# Altium schematic sheet MacroUzaz_Schematic.SchDoc
size 381 x 241 mm; SheetNumber: 1; SheetTotal: 1
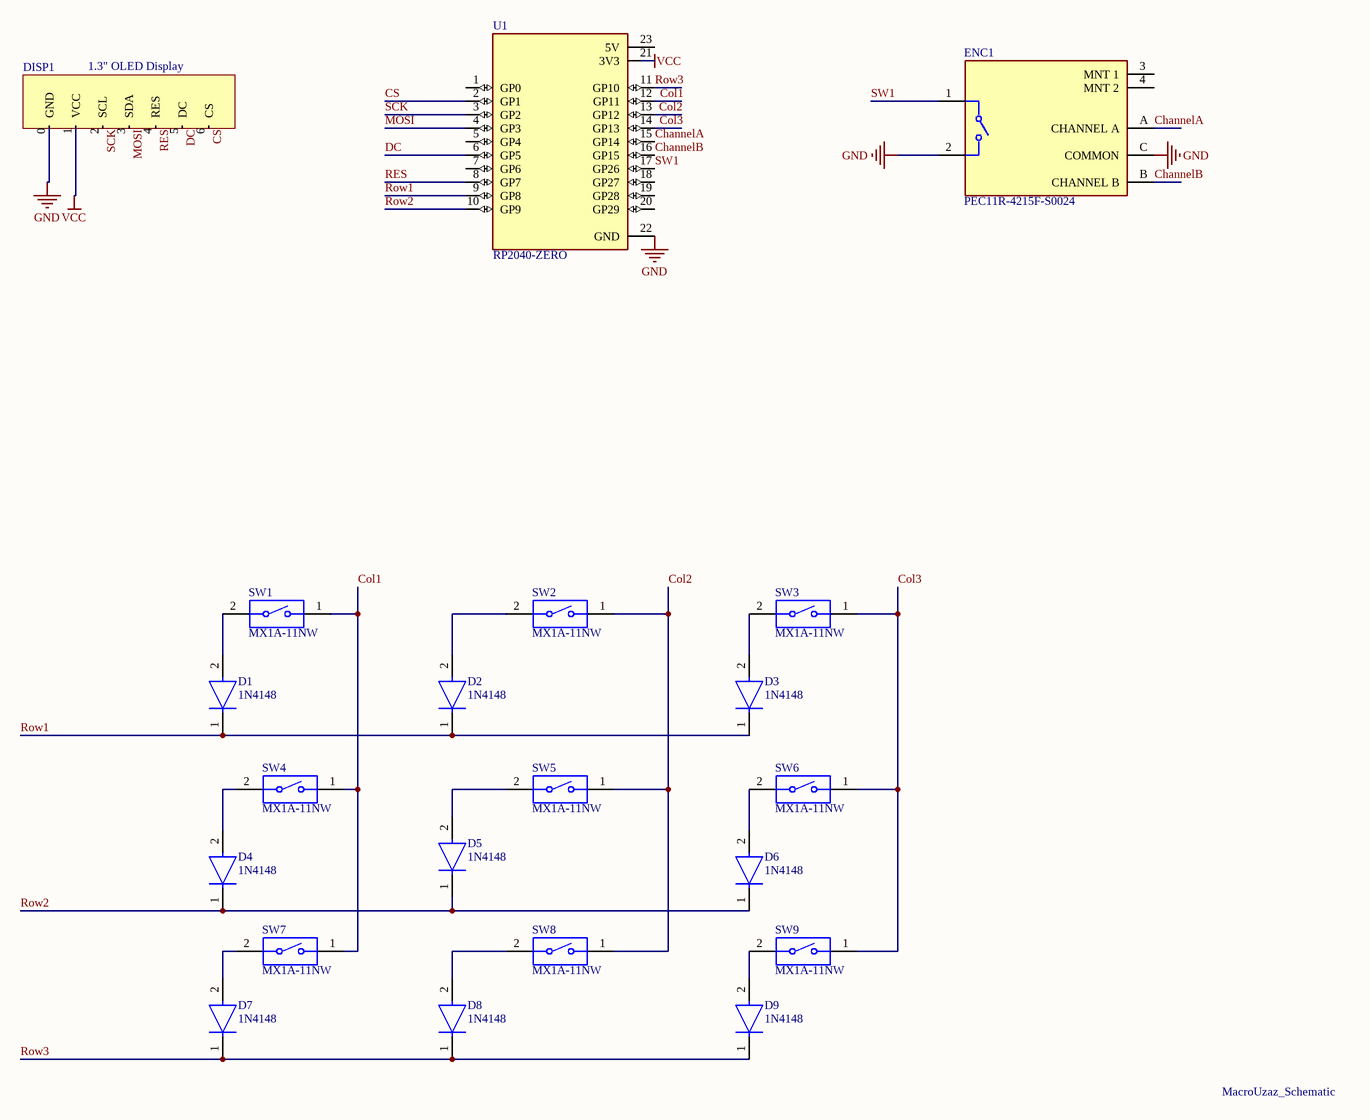
[diagram p0: MacroUzaz_Schematic.SchDoc]

## Parts
D1  1N4148  [FP-017AG-MFG]
D2  1N4148  [FP-017AG-MFG]
D3  1N4148  [FP-017AG-MFG]
D4  1N4148  [FP-017AG-MFG]
D5  1N4148  [FP-017AG-MFG]
D6  1N4148  [FP-017AG-MFG]
D7  1N4148  [FP-017AG-MFG]
D8  1N4148  [FP-017AG-MFG]
D9  1N4148  [FP-017AG-MFG]
DISP1  1.3" OLED Display  [OLED_Display]
ENC1  PEC11R-4215F-S0024  [FP-PEC11R-4215F-S0024-MFG]
SW1  MX1A-11NW  [CHRY-MX1A-11NW_V]
SW2  MX1A-11NW  [CHRY-MX1A-11NW_V]
SW3  MX1A-11NW  [CHRY-MX1A-11NW_V]
SW4  MX1A-11NW  [CHRY-MX1A-11NW_V]
SW5  MX1A-11NW  [CHRY-MX1A-11NW_V]
SW6  MX1A-11NW  [CHRY-MX1A-11NW_V]
SW7  MX1A-11NW  [CHRY-MX1A-11NW_V]
SW8  MX1A-11NW  [CHRY-MX1A-11NW_V]
SW9  MX1A-11NW  [CHRY-MX1A-11NW_V]
U1  RP2040-ZERO  [MODULE_RP2040-ZERO]

## Nets
GND: DISP1.0(GND) ENC1.2 ENC1.C(COMMON) U1.22(GND)
VCC: DISP1.1(VCC) U1.21(3V3)
ChannelA: ENC1.A(CHANNEL_A) U1.15(GP14)
ChannelB: ENC1.B(CHANNEL_B) U1.16(GP15)
Col1: SW1.1 SW4.1 SW7.1 U1.12(GP11)
Col2: SW2.1 SW5.1 SW8.1 U1.13(GP12)
Col3: SW3.1 SW6.1 SW9.1 U1.14(GP13)
CS: DISP1.6(CS) U1.2(GP1)
DC: DISP1.5(DC) U1.6(GP5)
MOSI: DISP1.3(SDA) U1.4(GP3)
RES: DISP1.4(RES) U1.8(GP7)
Row1: D1.1(C) D2.1(C) D3.1(C) U1.9(GP8)
Row2: D4.1(C) D5.1(C) D6.1(C) U1.10(GP9)
Row3: D7.1(C) D8.1(C) D9.1(C) U1.11(GP10)
SCK: DISP1.2(SCL) U1.3(GP2)
SW1: ENC1.1 U1.17(GP26)
NetD1_2: D1.2(A) SW1.2
NetD2_2: D2.2(A) SW2.2
NetD3_2: D3.2(A) SW3.2
NetD4_2: D4.2(A) SW4.2
NetD5_2: D5.2(A) SW5.2
NetD6_2: D6.2(A) SW6.2
NetD7_2: D7.2(A) SW7.2
NetD8_2: D8.2(A) SW8.2
NetD9_2: D9.2(A) SW9.2

Not connected (* = marked no-connect by the designer): ENC1 3(MNT_1) 4(MNT_2); U1 1(GP0) 5(GP4) 7(GP6) 18(GP27) 19(GP28) 20(GP29) 23(5V)

## Notes on the sheet
- MacroUzaz_Schematic

## Library data of the parts
D1-D9 = CMP-07163-000046-1: DIODE GEN PURP 100V 200MA DO35; Forward Voltage: 1V; Max Power Dissipation: 500mW; Max Reverse Current: 5uA; Forward Current: 300mA; Current: 4A; Reverse Recovery Time: 4ns; Element Configuration: Single; Outside Diameter: 1.85mm; Capacitance: 4pF; Polarity: Standard; Max Forward Surge Current (Ifsm): 1A; Reverse Voltage: 100V; Output Current: 200mA; Average Rectified Current: 200mA; Diameter: 1.91mm; Max Repetitive Reverse Voltage (Vrrm): 100V; Current Rating: 200mA; Case/Package: DO-35; Lead Free: Lead Free; Number of Pins: 2; Recovery Time: 4ns; Packaging: Bulk; Contact Plating: Tin; Voltage: 100V; Mount: Through Hole; Max Surge Current: 4A; Package Quantity: 2000; Width: 1.91mm; Max Reverse Voltage (DC): 100V; Length: 4.56mm; Radiation Hardening: No; Power Dissipation: 500mW; Voltage Rating (DC): 100V; Peak Non-Repetitive Surge Current: 4A; REACH SVHC: No SVHC; Height: 4.56mm; Max Operating Temperature: 175°C; Series: -; Weight: 0.01lb; Min Operating Temperature: -65°C
DISP1 = OLED_Connector
ENC1 = CMP-1747-00012-2: ROTARY ENCODER MECHANICAL 24PPR; Hole Diameter: 1.8mm; Output Type: Quadrature; Pulses per Revolution: 24; Number of Channels: 2; Built in Switch: Yes; Min Operating Temperature: -30°C; Series: PEC11R; Type: Mechanical; Package Quantity: 150; Length: 21.5mm; Max Operating Temperature: 70°C; Encoder Type: Mechanical; Height: 13.4mm; Detent: Yes; Packaging: Bulk; Orientation: Vertical; Width: 12.5mm; Termination: PC Pins; Mount: Through Hole; REACH SVHC: No SVHC; Radiation Hardening: No; RoHS Compliant: Yes
SW1-SW9 = CMP-2000-06786-1: Keylock Switch, 12 V, -10 to 70 degC, 2-Pin THD, RoHS, Bulk; Manufacturer: Cherry; Part No: MX1A11NW; Maximum DC Voltage Rating: 12V; COO: UK; Row Spacing: 6.35mm; Pole Throw Configuration: SPST; Total Travel: 4.06mm; Illumination Type: N/R; Actuator Style: Button; Operating Force: 0.58N; Electrical Life: 50000000Cycle; Minimum Insulation Resistance: 100MOhm; Body Orientation: Straight; Actuator Length: 3.6mm; Switch Configuration: N.O.; Maximum Current Rating: 0.01A; Maximum Contact Resistance: 200mOhm; Actuator Color: N/A; Terminal Type: PCPins; Operating Temperature: -10to70C; Number of Terminals: 2; Operating Speed: N/A; Maximum AC Voltage Rating: 12V; Housing Material: N/A; Datasheet URL: https://cdn.sparkfun.com/datasheets/Components/Switches/MX%20Series.pdf; Type: DesktopProfile; Terminal Pitch: 2.54mm; Package Reference: MX1A-11NW; ECCN: EAR99; Family: MX; Packaging: N/A; HTS: 8536509065; Actuator Material: N/A; Package Description: 2-Pin Through Hole Device, Body 15.6 x 15.6 mm; Dielectric Strength: N/A; Illumination Color: N/R; Manufacturer URL: http://cherryswitches.com/cn/; Dimension: 15.6x15.6x15.2mm; Mechanical Life: N/A; RoHS: Unknown; Contact Plating: N/A; Supplier: CherryElectrical; Contact Material: Silver/Gold; IP Rating: N/A; Mounting: ThroughHole; Datasheet Version: 09/2000; Maximum Power Rating: N/A; Mounting Technology: ThroughHole
U1 = CMP-003-000000-1: Low-Cost, High-Performance Pico-Like MCU Board Based On Raspberry Pi Microcontroller RP2040; MF: Waveshare Electronics; MP: RP2040-ZERO; Component Type: Standard; Design Item ID: RP2040-ZERO; Value: *; Check_prices: https://www.snapeda.com/parts/RP2040-ZERO/Waveshare+Electronics/view-part/?ref=eda; Package: Package; Source: RP2040-ZERO.SchLib; Pin Count: 23; SnapEDA_Link: https://www.snapeda.com/parts/RP2040-ZERO/Waveshare+Electronics/view-part/?ref=snap